# EAGLE design mcp1824bo (EAGLE 8.1.0)
PART_NUM: MCP1824BO; REV: B; TITLE: MCP1824-ADJ Breakout
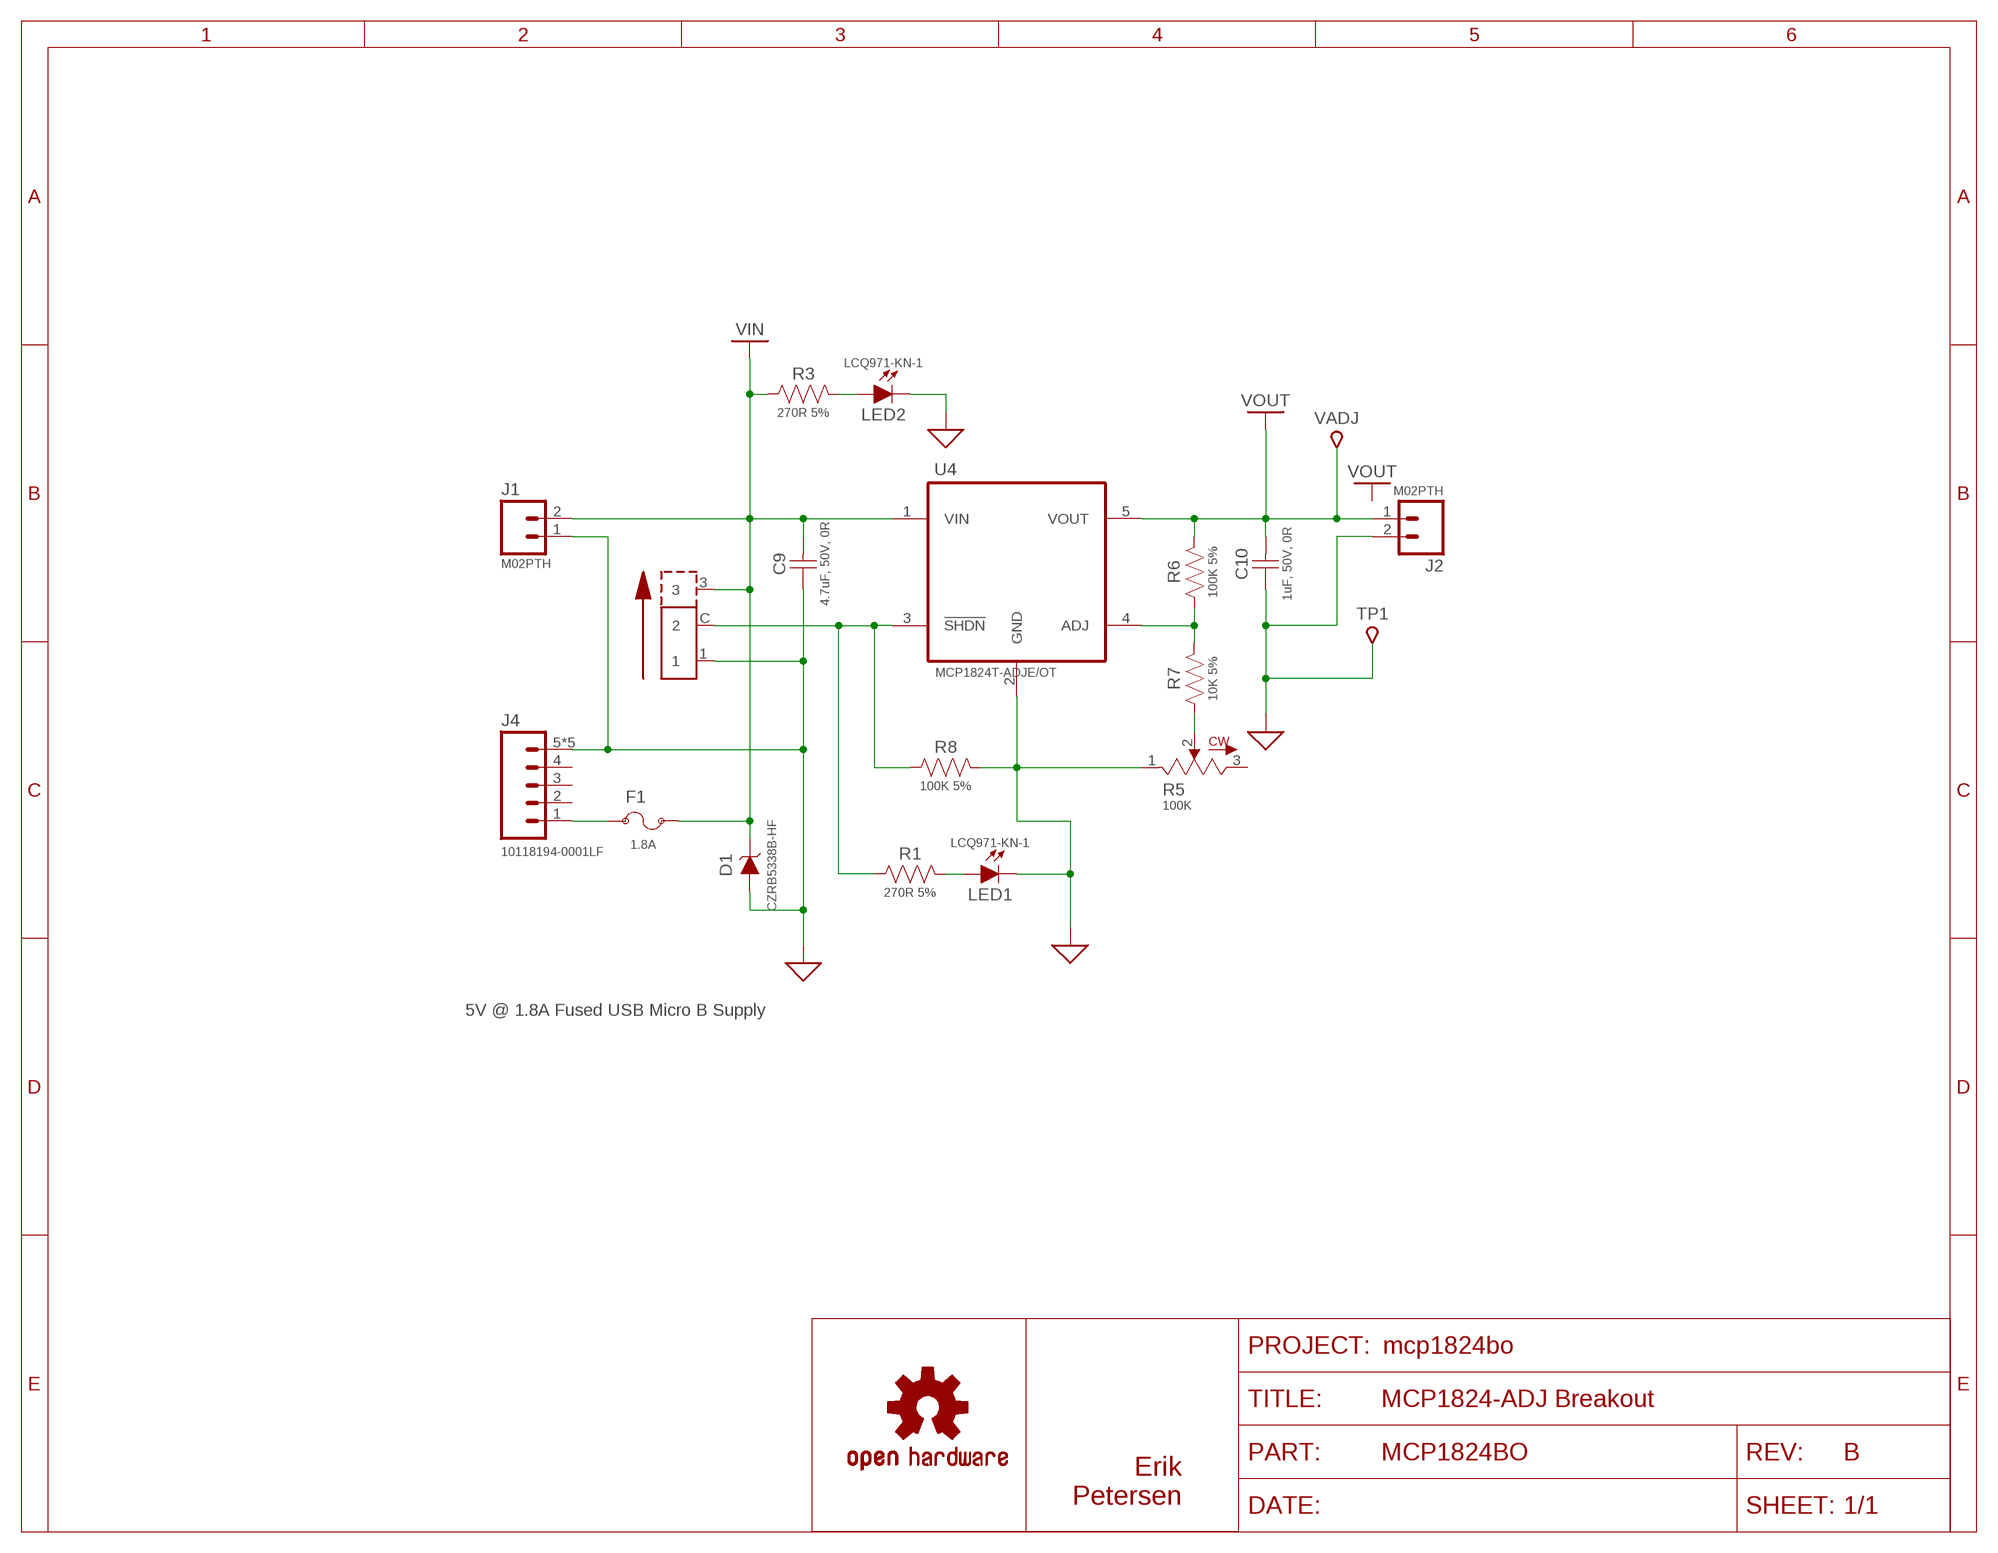
[diagram p0: schematic, sheet 1]

## Parts
C9  4.7uF, 50V, 0R  GRM31CR71H475KA12L  [31-1206]
C10  1uF, 50V, 0R  GRM21BR71H105KA12L  [21-0805]
D1  CZRB5338B-HF  [DO-214AA]
F1  1.8A  1206L100  [1206]
J1  M02PTH  [1X02]
J2  M02PTH  [1X02]
J4  10118194-0001LF  M05USB-MICRO  [USB-MICROB]
LED1  LCQ971-KN-1  LEDCHIPLED_0603  [CHIPLED_0603]
LED2  LCQ971-KN-1  LEDCHIPLED_0603  [CHIPLED_0603]
LOGO1  OSHW-LOGOS  [OSHW-LOGO-S]
R1  270R 5%  ERJ-3GEYJ271  [R0603]
R3  270R 5%  ERJ-3GEYJ271  [R0603]
R5  100K  T93YA104KT20  [T93YA]
R6  100K 5%  ERJ-3GEYJ104  [R0603]
R7  10K 5%  ERJ-3GEYJ103  [R0603]
R8  100K 5%  ERJ-3GEYJ104  [R0603]
SW1  CL-SB-12A-01  [CL-SB-12A]
TP1  TP-5001K-040  [TP5000K-040]
U4  MCP1824T-ADJE/OT  [SOT95P270X145-5N]
VADJ  TP-5000K-040  [TP5000K-040]

## Nets
ADJ: R6.1 R7.2 U4.4(ADJ)
ADJ2: R5.2 R7.1
GND: C9.1 C10.1 D1.A J1.1 J2.2 J4.5 J4.6 J4.7 J4.8 J4.9 LED1.C LED2.C R5.1 R8.2 SW1.1 TP1.PP U4.2(GND)
LED1: LED1.A R1.2
LED2: LED2.A R3.2
SHDN: R1.1 R8.1 SW1.C U4.3(!SHDN)
VIN: C9.2 D1.C F1.2 J1.2 R3.1 SW1.3 U4.1(VIN)
VOUT: C10.2 J2.1 R6.2 U4.5(VOUT) VADJ.PP
VUSB: F1.1 J4.1
Unconnected: J4.2 J4.3 J4.4 R5.3

## Notes on the sheet
- 5V @ 1.8A Fused USB Micro B Supply

## Library data of the parts
C9 = C3-Murata:GRM31CR71H475KA12L; CAP: 4.7E-6; ESR: 0.0; IRMS: 0.0; MANUFACTURER_NAME: MuRata; MANUFACTURER_PART_NUMBER: GRM31CR71H475KA12L; VDC: 50.0; VENDOR: MuRata
C10 = C3-Murata:GRM21BR71H105KA12L; CAP: 1.0E-6; ESR: 0.0; IRMS: 0.0; MANUFACTURER_NAME: MuRata; MANUFACTURER_PART_NUMBER: GRM21BR71H105KA12L; VDC: 50.0; VENDOR: MuRata
D1 = C3-Comchip:CZRB*?: Comchip 5W SMD Zener Diode Datasheet <http://www.comchiptech.com/cms/UserFiles/CZRB5338B-HF%20Thru111480.%20CZRB5388B-HF%20RevA.pdf> Digikey Catalog <https://www.digikey.ca/products/en/discrete-semiconductor-products/diodes-zener-single/287?k=&pkeyword=&pv588=4&FV=fffc0281%2Cffe0011f%2C1140003&mnonly=0&newproducts=0&ColumnSort=0&page=1&quantity=0&ptm=0&fid=0&pageSize=25>; VZ: 5.1; ZMAX: 1.5
F1 = C3-Littelfuse:1206L*: POLYFUSE® Resettable PTCs 1206L Series; I-HOLD: 1A
J1 J2 = C3-Connector:M02: Standard 2-pin 0.1" header. Use with - straight break away headers ( PRT-00116) - right angle break away headers (PRT-00553) - swiss pins (PRT-00743) - machine pins (PRT-00117) - female headers (PRT-00115) Molex polarized connector foot print use with: PRT-08233 with associated crimp pins and housings. 2.54_SCREWTERM for use with PRT-10571. 3.5mm Screw Terminal footprints for PRT-08084 5mm Screw Terminal footprints for use with PRT-08433
J4 = C3-Connector:M05: Header 5 Standard 5-pin 0.1" header. Use with straight break away headers (SKU : PRT-00116), right angle break away headers (PRT-00553), swiss pins (PRT-00743), machine pins (PRT-00117), and female headers (PRT-00115). Molex polarized connector foot print use with SKU : PRT-08230 with associated crimp pins and housings.
LED1 LED2 = C3-LED:LED: Generic LED
LOGO1 = C3-General:OSHW-LOGO: Open Source Hardware Logo This logo indicates the piece of hardware it is found on incorporates a OSHW license and/or adheres to the definition of open source hardware found here: http://freedomdefined.org/OSHW
R1 R3 R6-R8 = C3-Panasonic:ERJ-?*: Panasonic ERJ Thick Film Chip Resistor
R5 = C3-Vishay:T93?*KT20: VISHAY T93 Series Cermet Style Trimmer Potentiometers Datasheet <http://www.vishay.com/docs/51026/t93.pdf> Cheaper alternative to Bourns 3296 Trimpots The T93 is a small size trimmer - 3/8" x 3/8" x 3/16" - answering PC board mounting requirements. Five versions are available which differ by the position of the control screw in relation to the PC board plane and by the spacing of the terminals. Excellent operational stability is provided by the use of a cermet element.
SW1 = C3-Switches:CL-SB-12?-*: Copal CL-SB Series Slide Switch; ACTION: TOP; PLATING: SILVER
TP1 = C3-General:TP-50*K-?: Keystone 5000 Series Test Points; COLOR: BLACK
U4 = C3-Microchip:MCP1824T-ADJE/OT: Low Quiescent Current LDO Regulator; MPN: MCP1824T-ADJE/OT; OC_FARNELL: 1578393; OC_NEWARK: 40M0692; PACKAGE: SOT-5; SUPPLIER: Microchip
VADJ = C3-General:TP-50*K-?: Keystone 5000 Series Test Points; COLOR: RED

## Board
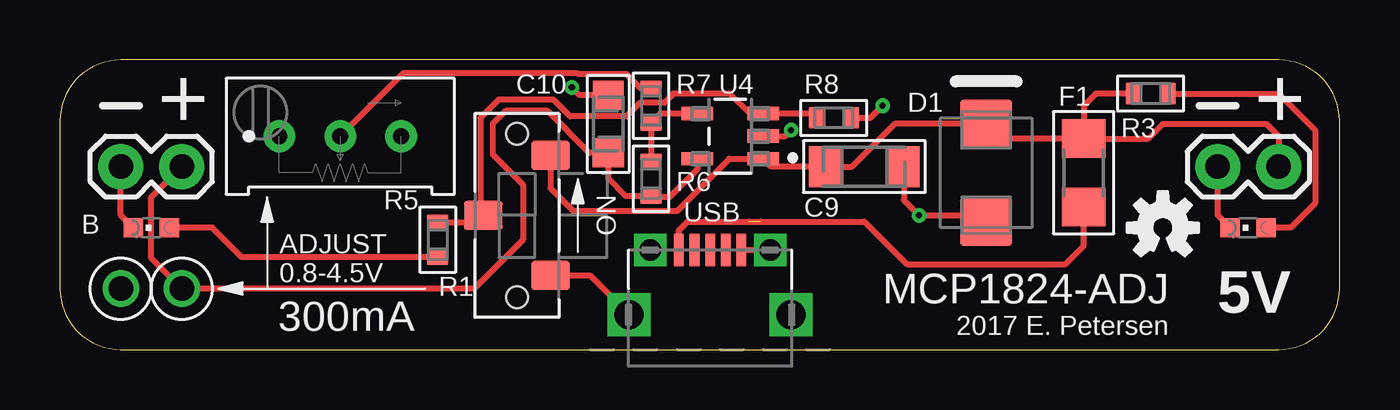
[diagram p1: board, top side]
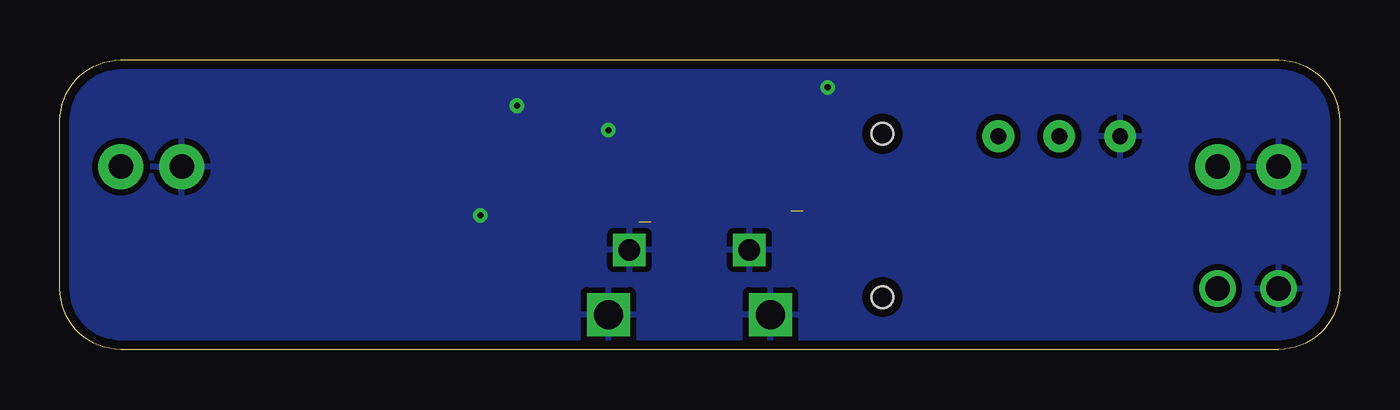
[diagram p2: board, bottom side, seen from below]

Size 53.34 x 12.06 mm. Coordinates in mm from the lower left corner, seen from the top.
Outline: 2.54,0 50.8,0 arc90 53.34,2.54 53.34,9.53 arc90 50.8,12.06 2.54,12.06 arc90 0,9.53 0,2.54 arc90 2.54,0
Copper layers (1*16): Top 0.0356mm / dielectric 1.5011mm / Bottom 0.0356mm
Design rules "oshpark-2layer": minimum track width 6mil, minimum drill 10mil, track to track 6mil, track to pad 6mil, pad to pad 6mil, via to via 6mil, smd to smd 6mil, copper to edge 15mil, drill to drill 6mil, minimum pad ring 7mil, minimum via ring 7mil, stop-mask expansion 2.5mil, vias tented up to drill 0mil, thermal gap 10mil

### Footprints (pad centres in the part's own frame; a part is rotated, then mirrored left to right if it is on the bottom)
31-1206 = smd 1.3 x 1.7: 1 -1.65,0; 2 1.65,0
21-0805 = smd 1.2 x 1.3: 1 -1.2,0; 2 1.2,0
DO-214AA = smd 2.032 x 2.159: A 2.032,0; C -2.032,0
1206 = smd 1.6 x 1.803: 1 -1.422,0; 2 1.422,0
1X02 = drill 1.016 pad 1.88: 1 0,0; 2 2.54,0
USB-MICROB = smd 0.4 x 1.35: 1 -1.3,2.7; 2 -0.65,2.7; 3 0,2.7; 4 0.65,2.7; 5 1.3,2.7 | drill 0.9 pad 1.3 square: 6 -2.5,2.7; 7 2.5,2.7 | drill 1.2 pad 1.65 square: 8 -3.375,0; 9 3.375,0
CHIPLED_0603 = smd 0.8 x 0.8: A 0,-0.75; C 0,0.75
R0603 = smd 0.65 x 0.9: 1 -0.725,0; 2 0.725,0
T93YA = drill 0.66 pad 1.321: 1 -2.54,0; 2 0,0; 3 2.54,0
CL-SB-12A = smd 1.2 x 1.6: 1 -2.5,-1.4; 3 2.5,-1.4; C 0,1.4 | hole 0.9: -3.4,0; 3.4,0
TP5000K-040 = drill 1.016: PP 0,0
SOT95P270X145-5N = smd 1.321 x 0.559: 1 -1.372,0.94; 2 -1.372,0; 3 -1.372,-0.94; 4 1.372,-0.94; 5 1.372,0.94

### Placement (x,y rotation side)
C9  33.53,7.62 180 top
C10  22.86,9.4 270 top
D1  38.61,7.37 270 top
F1  42.67,7.37 90 top
J1  48.26,7.62 0 top
J2  5.08,7.62 180 top
J4  27.1,1.45 0 top
LED1  3.81,5.08 90 top
LED2  49.53,5.08 90 top
LOGO1  45.97,5.08 0 top
R1  15.75,4.57 270 top
R3  45.47,10.67 0 top
R5  11.68,8.89 0 top
R6  24.64,7.11 270 top
R7  24.64,10.16 270 top
R8  32.26,9.65 0 top
SW1  19.05,5.59 90 top
TP1  2.54,2.54 0 top
U4  27.94,8.89 180 top
VADJ  5.08,2.54 0 top

### Tracks (layer width: path | path; a pad name or v marks a point on that pad's centre or on a via)
ADJ
  Top 0.254: U4.4 25.03,9.83 R7.2 R6.1
ADJ2
  Top 0.254: R7.1 24.21,10.88 23.62,11.48 21.61,11.48 21.58,11.51 14.3,11.51 R5.2
GND  (via drill 0.25 pad 0.51)
  Top 0.254: D1.A 38.35,5.59 v35.81,5.59 35.18,6.22 C9.1 | U4.2 30.23,8.89 v30.48,9.14 | R8.2 33.78,9.65 v34.29,10.16 | LED2.C 48.26,5.6 J1.1 | LED1.C 2.54,5.6 J2.2 | J4.5 J4.7 | SW1.1 22.09,3.09 J4.8 | C10.1 21.66,10.6 v21.34,10.92
  pour Bottom (isolate 0.254): 0,10.16 0,2.54 arc90 2.54,0 50.8,0 arc90 53.34,2.54 53.34,10.16 arc90 50.8,12.06 2.54,12.06 arc90
LED1
  Top 0.254: 4.83,5.08 LED1.A 6.35,5.08 7.58,3.85 R1.2
LED2
  Top 0.254: R3.2 50.8,10.67 52.32,9.14 52.32,6.1 51.31,5.08 LED2.A
SHDN
  Top 0.254: R8.1 31.36,9.83 U4.3 28.78,9.83 27.94,10.67 25.57,10.67 25.18,10.28 24.18,10.28 23.62,9.72 21.27,9.72 20.57,10.41 18.29,10.41 17.53,9.65 17.53,5.71 SW1.C 17.36,5.3 R1.1
VIN  (1 unrouted)
  Top 0.254: F1.2 39.22,8.79 D1.C 34.8,9.4 33.02,7.62 C9.2 29.64,7.62 U4.1 27.9,7.95 25.74,5.78 22.36,5.78 | F1.2 45.36,8.79 45.97,9.4 50.29,9.4 50.8,8.89 J1.2 | R3.1 43.18,10.67 42.67,10.16 F1.2 | 22.86,5.78 21.39,5.78 20.45,6.73 SW1.3
VOUT
  Top 0.254: U4.5 26.57,7.52 25.4,6.35 24.68,6.35 R6.2 23.59,6.39 22.86,7.11 C10.2 22.07,8.2 20.32,9.95 18.58,9.95 18.03,9.4 18.03,8.13 19.3,6.86 19.3,4.57 17.27,2.54 VADJ.PP 3.81,3.81 3.81,6.35 J2.1
VUSB  (1 unrouted)
  Top 0.254: 28.7,5.33 33.53,5.33 35.31,3.56 41.91,3.56 42.67,4.32 F1.1 | 29.21,5.33 26.16,5.33 25.8,4.97 J4.1

### Text on the board
tPlace: + | + | ON | ADJUST / 0.8-4.5V | USB | 5V | 300mA